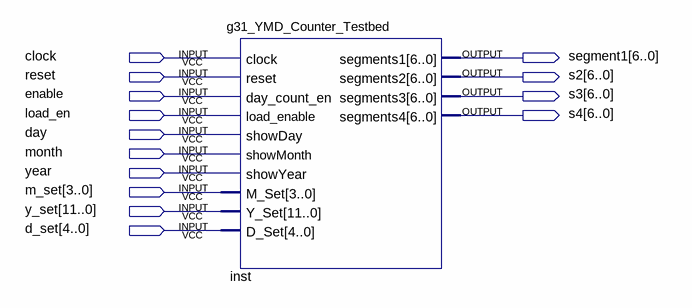
[diagram p0: schematic sheet]
// Quartus schematic g31_YMD_counter_testbed_circuit.bdf as structural Verilog: 1 symbols, 14 pins
module g31_YMD_counter_testbed_circuit (
  input  clock,
  input  reset,
  input  enable,
  input  load_en,
  input  day,
  input  month,
  input  year,
  input  [3:0] m_set,
  input  [11:0] y_set,
  input  [4:0] d_set,
  output [6:0] segment1,
  output [6:0] s2,
  output [6:0] s3,
  output [6:0] s4
);

  g31_YMD_Counter_Testbed inst (
    .clock(clock), .reset(reset), .day_count_en(enable), .load_enable(load_en), .showDay(day),
    .showMonth(month), .showYear(year), .M_Set(m_set), .Y_Set(y_set), .D_Set(d_set), .segments1(segment1),
    .segments2(s2), .segments3(s3), .segments4(s4));
endmodule
